# EAGLE design eggDrop (EAGLE 9.3.2)
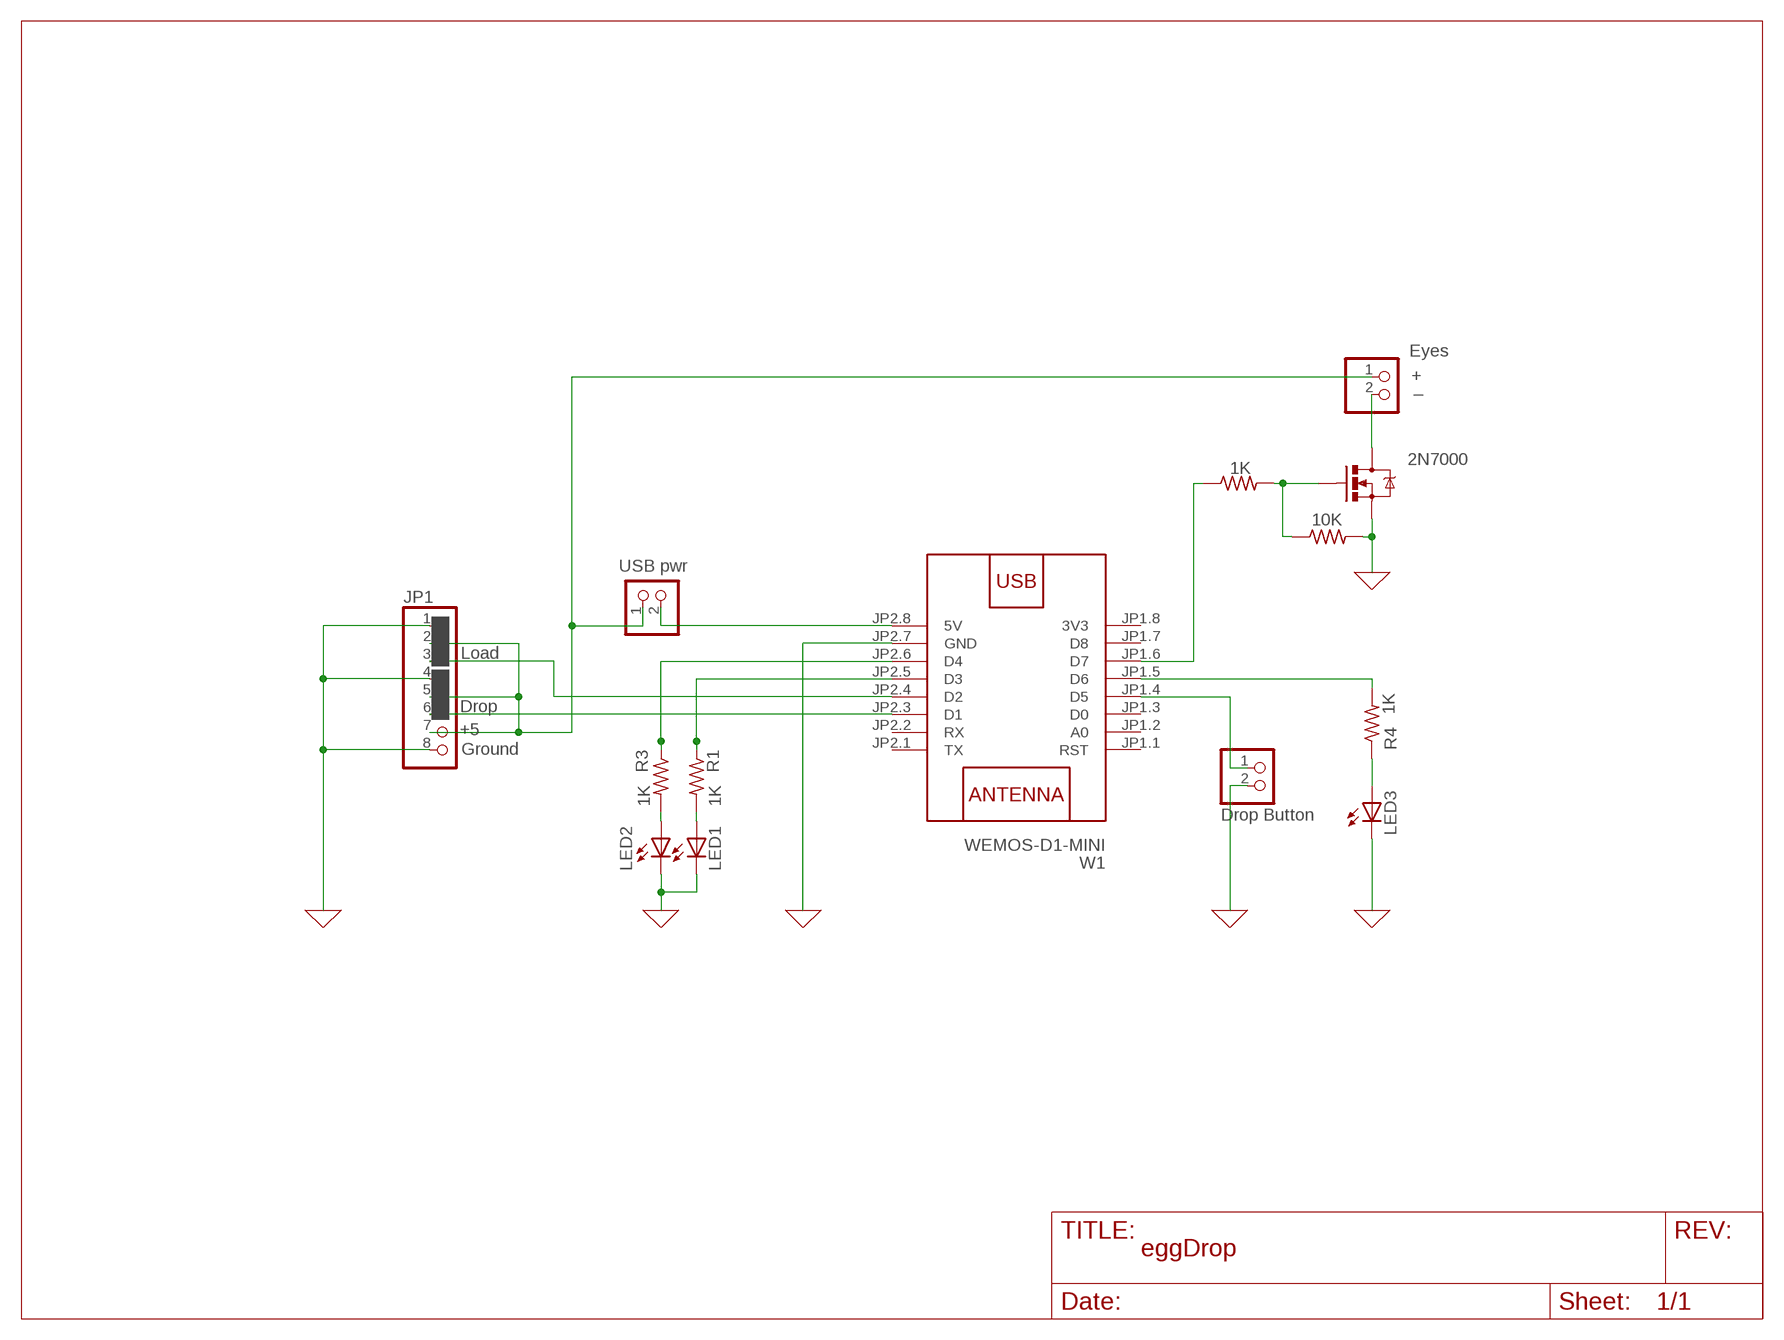
[diagram p0: schematic, sheet 1]

## Parts
2N7000  MOSFET-NCHANNEL2N7000  [TO-92]
JP1  PINHD-1X8BIG  [1X08-BIG]
JP2  USB pwr  PINHD-1X2  [1X02]
JP3  Drop Button  PINHD-1X2  [1X02]
JP4  Eyes  PINHD-1X2  [1X02]
LED1  LED5MM  [LED5MM]
LED2  LED5MM  [LED5MM]
LED3  LED5MM  [LED5MM]
R1  1K  R-US_0207/10  [0207/10]
R2  10K  R-US_0207/10  [0207/10]
R3  1K  R-US_0207/10  [0207/10]
R4  1K  R-US_0207/10  [0207/10]
R5  1K  R-US_0207/10  [0207/10]
W1  WEMOS-D1-MINI  [WEMOS-D1-MINI]

## Nets
0: 2N7000.1(S) JP1.1 JP1.4 JP1.8 JP3.2 LED1.K(C) LED2.K(C) LED3.K(C) R2.2 W1.JP2.7(GND) ; supply symbol labelled GND
N$1: JP1.2 JP1.5 JP1.7 JP2.1 JP4.1
N$2: JP2.2 W1.JP2.8(5V)
N$3: 2N7000.3(D) JP4.2
N$4: JP1.6 W1.JP2.3(D1)
N$5: R3.1 W1.JP2.6(D4)
N$6: LED1.A R1.2
N$7: LED2.A R3.2
N$8: R4.2 W1.JP1.5(D6)
N$9: LED3.A R4.1
N$10: JP3.1 W1.JP1.4(D5)
N$11: JP1.3 W1.JP2.4(D2)
N$12: R1.1 W1.JP2.5(D3)
N$13: 2N7000.2(G) R2.1 R5.2
N$14: R5.1 W1.JP1.6(D7)
Unconnected: W1.JP1.1(RST) W1.JP1.2(A0) W1.JP1.3(D0) W1.JP1.7(D8) W1.JP2.1(TX) W1.JP2.2(RX)

## Notes on the sheet
- +
- _
- Load
- Drop
- +5
- Ground

## Power pins joined to a net without a drawn wire
3V3: W1.JP1.8(3V3)

## Library data of the parts
2N7000 = digikey:MOSFET-NCHANNEL: Common NMOSFET Parts MFG P/N Store ID Prod ID FDD8780 TRANS-09984 SI7820DN TRANS-11055 FDS6630A IC-08089 2N7002PW TRANS-11151 FQP30N06L COM-10213 TRANS-10060 BSS123LT1G TRANS-08345 BSS138 TRANS-00830 BS170 2N7000
JP1 = adafruit:PINHD-1X8: PIN HEADER
JP2-JP4 = DC_LOAD_AU:PINHD-1X2: PIN HEADER
LED1-LED3 = adafruit:LED: LED OSRAM: - CHIPLED LG R971, LG N971, LY N971, LG Q971, LY Q971, LO R971, LY R971 LH N974, LH R974 LS Q976, LO Q976, LY Q976 LO Q996 - Hyper CHIPLED LW Q18S LB Q993, LB Q99A, LB R99A - SideLED LS A670, LO A670, LY A670, LG A670, LP A670 LB A673, LV A673, LT A673, LW A673 LH A674 LY A675 LS A676, LA A676, LO A676, LY A676, LW A676 LS A679, LY A679, LG A679 - Hyper Micro SIDELED® LS Y876, LA Y876, LO Y876, LY Y876 LT Y87S - SmartLED LW L88C, LW L88S LB L89C, LB L89S, LG L890 LS L89K, LO L89K, LY L89K LS L896, LA L896, LO L896, LY L896 - TOPLED LS T670, LO T670, LY T670, LG T670, LP T670 LSG T670, LSP T670, LSY T670, LOP T670, LYG T670 LG T671, LOG T671, LSG T671 LB T673, LV T673, LT T673, LW T673 LH T674 LS T676, LA T676, LO T676, LY T676, LB T676, LH T676, LSB T676, LW T676 LB T67C, LV T67C, LT T67C, LS T67K, LO T67K, LY T67K, LW E67C LS E67B, LA E67B, LO E67B, LY E67B, LB E67C, LV E67C, LT E67C LW T67C LS T679, LY T679, LG T679 LS T770, LO T770, LY T770, LG T770, LP T770 LB T773, LV T773, LT T773, LW T773 LH T774 LS E675, LA E675, LY E675, LS T675 LS T776, LA T776, LO T776, LY T776, LB T776 LHGB T686 LT T68C, LB T68C - Hyper Mini TOPLED® LB M676 - Mini TOPLED Santana® LG M470 LS M47K, LO M47K, LY M47K Source: http://www.osram.convergy.de/
R1-R5 = adafruit:R-US_: RESISTOR, American symbol
W1 = diy-modules:WEMOS-D1-MINI: WEMOS D1 mini: Mini Wi-Fi Board based on ESP-8266 device More details can be found here: https://www.wemos.cc/product/d1-mini.html Click here to find device on ebay.com <http://www.ebay.com/sch/wemos+d1+mini+nodemcu>

## Board
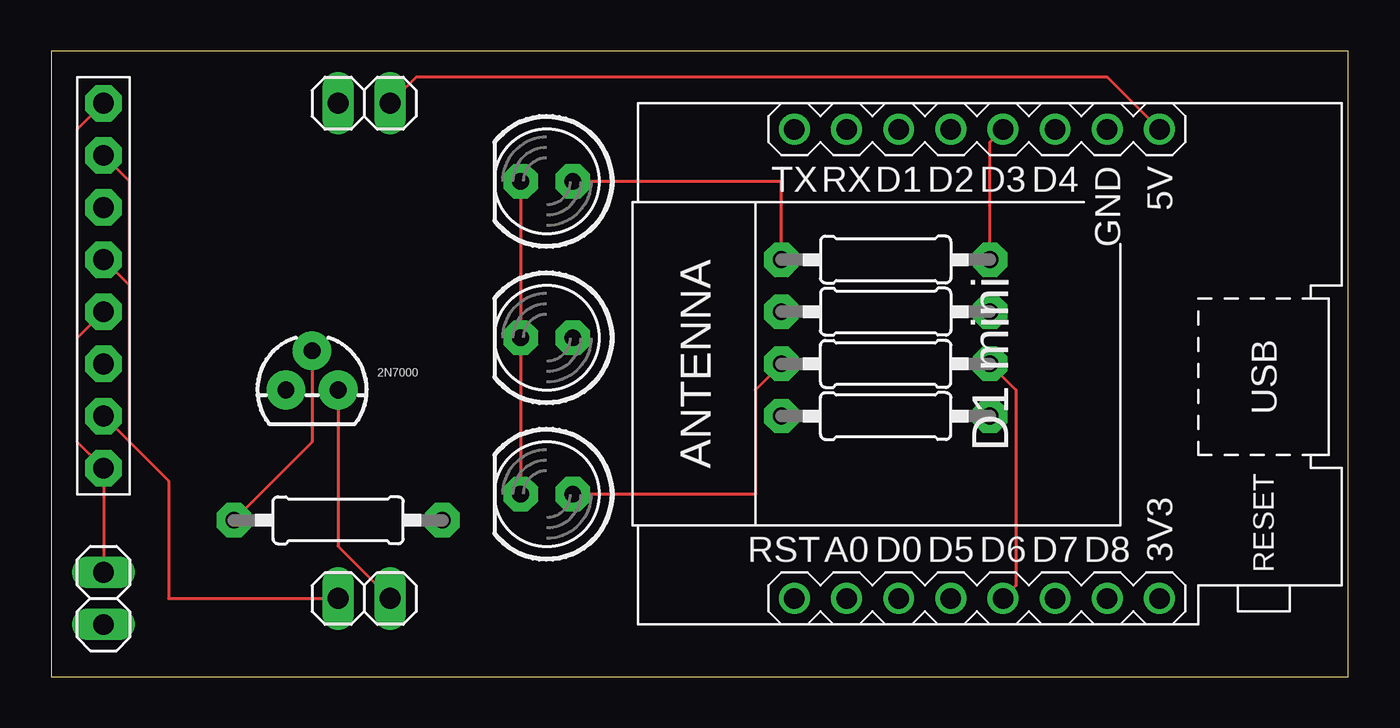
[diagram p1: board, top side]
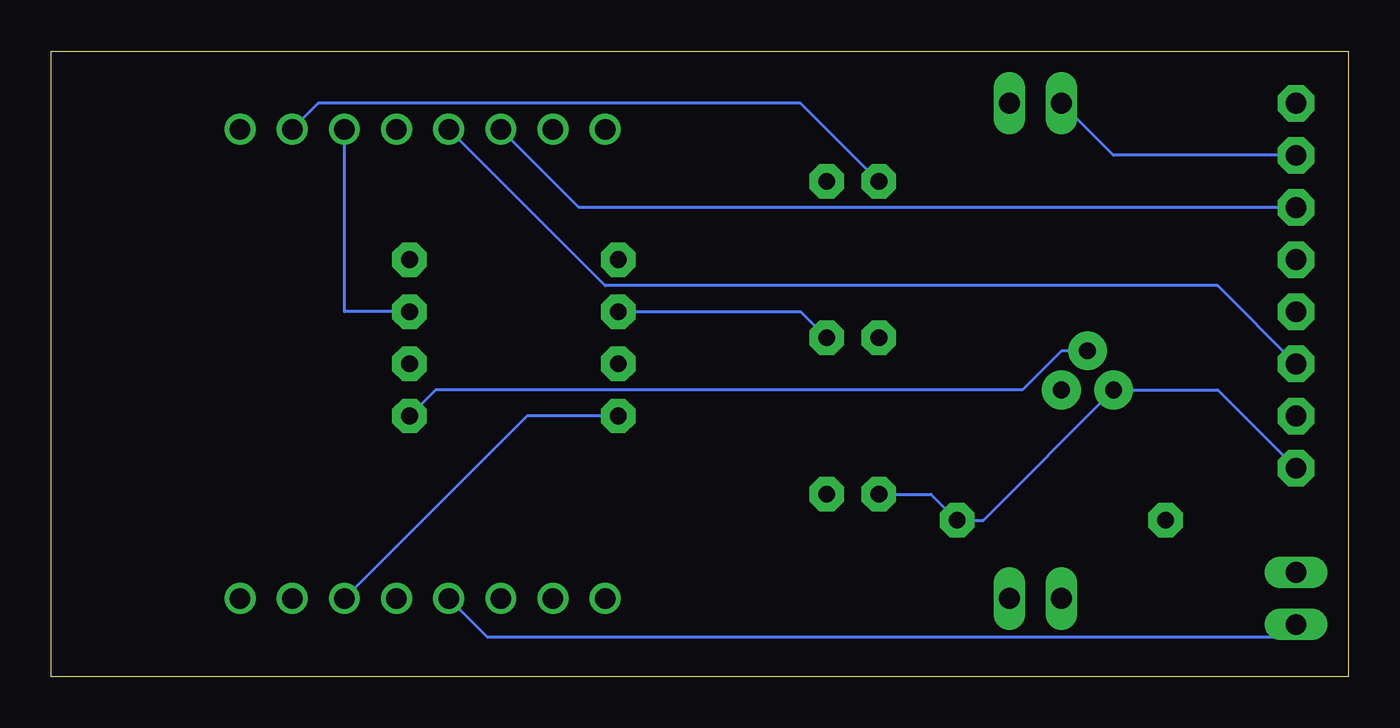
[diagram p2: board, bottom side, seen from below]

Size 63.17 x 30.47 mm. Coordinates in mm from the lower left corner, seen from the top.
Outline: 0,0 63.17,0 63.17,30.47 0,30.47 0,0
Copper layers (1*16): Top 0.035mm / dielectric 1.5mm / Bottom 0.035mm
Design rules "default": minimum track width 6mil, minimum drill 0.35mm, track to track 6mil, track to pad 6mil, pad to pad 6mil, via to via 6mil, smd to smd 6mil, copper to edge 40mil, drill to drill 6mil, minimum pad ring 10mil, minimum via ring 8mil, stop-mask expansion 4mil, vias tented up to drill 0mil, thermal gap 10mil

### Footprints (pad centres in the part's own frame; a part is rotated, then mirrored left to right if it is on the bottom)
TO-92 = drill 0.813 pad 1.88: 1 -1.27,0; 2 0,1.905; 3 1.27,0
1X08-BIG = drill 1.016 pad 1.778 octagon: 1 -8.89,0; 2 -6.35,0; 3 -3.81,0; 4 -1.27,0; 5 1.27,0; 6 3.81,0; 7 6.35,0; 8 8.89,0
1X02 = drill 1.016 long: 1 -1.27,0; 2 1.27,0
LED5MM = drill 0.813 pad 1.676 octagon: A -1.27,0; K 1.27,0
0207/10 = drill 0.813 pad 1.676 octagon: 1 -5.08,0; 2 5.08,0
WEMOS-D1-MINI = drill 1: JP1.1 -11.43,9.525; JP1.2 -11.43,6.985; JP1.3 -11.43,4.445; JP1.4 -11.43,1.905; JP1.5 -11.43,-0.635; JP1.6 -11.43,-3.175; JP1.7 -11.43,-5.715; JP1.8 -11.43,-8.255; JP2.1 11.43,9.525; JP2.2 11.43,6.985; JP2.3 11.43,4.445; JP2.4 11.43,1.905; JP2.5 11.43,-0.635; JP2.6 11.43,-3.175; JP2.7 11.43,-5.715; JP2.8 11.43,-8.255

### Placement (x,y rotation side)
2N7000  12.7,13.97 0 top
JP1  2.54,19.05 90 top
JP2  15.24,27.94 0 top
JP3  2.54,3.81 90 top
JP4  15.24,3.81 0 top
LED1  24.13,24.13 180 top
LED2  24.13,16.51 180 top
LED3  24.13,8.89 180 top
R1  40.64,20.32 180 top
R2  13.97,7.62 0 top
R3  40.64,17.78 180 top
R4  40.64,15.24 0 top
R5  40.64,12.7 0 top
W1  45.72,15.24 90 top

### Tracks (layer width: path | path; a pad name or v marks a point on that pad's centre or on a via)
0
  Top 0.152: JP3.2 JP1.1 1.27,11.43 1.27,16.51 | 1.27,16.51 JP1.4 | JP1.8 1.27,26.67 1.27,16.51 | LED1.K LED2.K LED3.K
  Bottom 0.152: LED3.K 20.32,8.89 R2.2 17.78,7.62 2N7000.1 6.35,13.97 JP1.1 | W1.JP2.7 50.16,27.94 26.67,27.94 LED1.K
N$1
  Top 0.152: JP4.1 5.71,3.81 5.71,9.52 3.81,11.43 | JP1.2 3.81,11.43 | 3.81,19.05 JP1.5 | 3.81,11.43 3.81,19.05 | JP1.7 3.81,24.13 3.81,19.05
  Bottom 0.152: JP2.1 11.43,25.4 JP1.7
N$2
  Top 0.152: W1.JP2.8 51.44,29.21 17.78,29.21 JP2.2
N$3
  Top 0.152: JP4.2 13.97,6.35 2N7000.3
N$4
  Bottom 0.152: W1.JP2.3 37.47,22.86 JP1.6
N$5
  Bottom 0.152: W1.JP2.6 48.9,17.78 R3.1
N$6
  Top 0.152: LED1.A 35.56,24.13 R1.2
N$7
  Bottom 0.152: LED2.A 26.67,17.78 R3.2
N$8
  Top 0.152: W1.JP1.5 46.99,4.45 46.99,13.97 R4.2
N$9
  Top 0.152: LED3.A 34.29,8.89 34.29,13.97 R4.1
N$10
  Bottom 0.152: W1.JP1.4 41.91,1.91 3.17,1.91 JP3.1
N$11
  Bottom 0.152: W1.JP2.4 36.2,19.05 6.35,19.05 JP1.3
N$12
  Top 0.152: W1.JP2.5 45.72,26.03 R1.1
N$13
  Top 0.152: R2.1 12.7,11.43 2N7000.2
  Bottom 0.152: R5.2 44.45,13.97 15.88,13.97 13.97,15.88 2N7000.2
N$14
  Bottom 0.152: W1.JP1.6 40.01,12.7 R5.1

### Text on the board
bValues: +